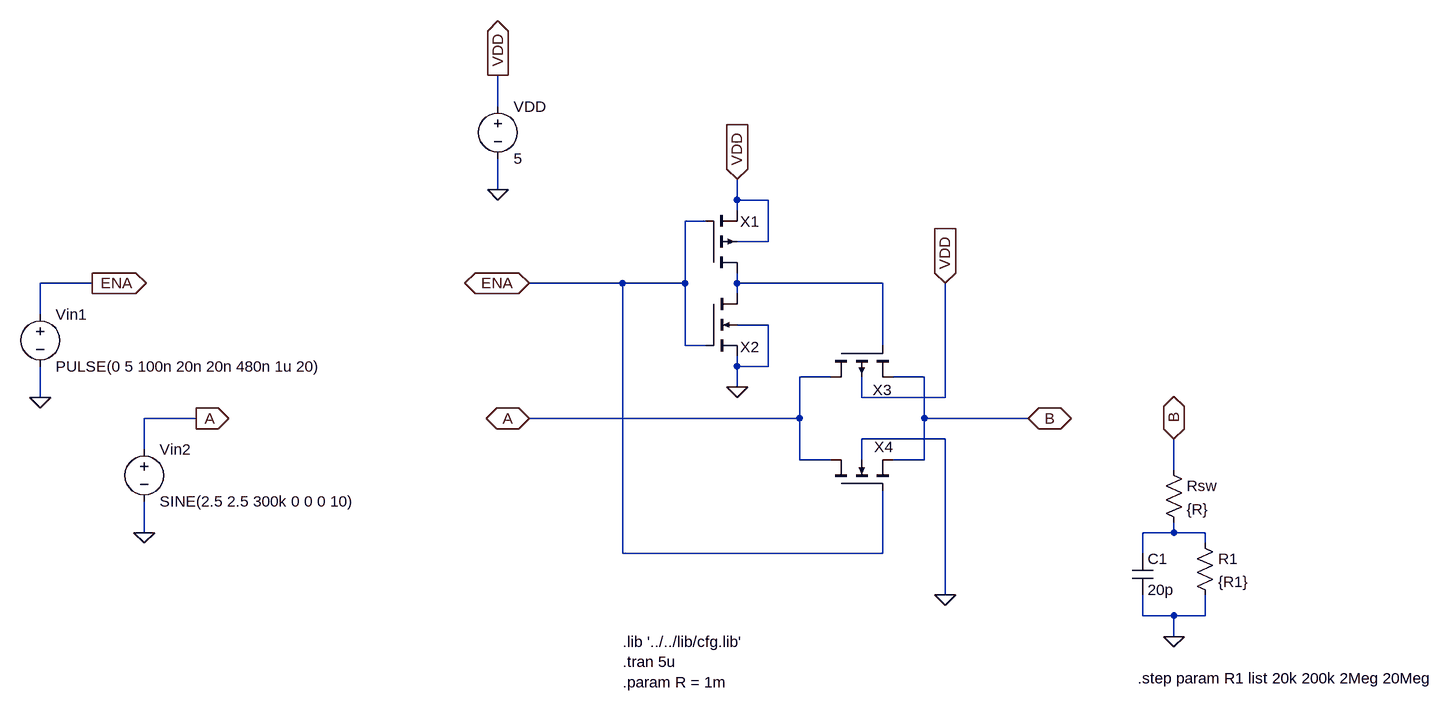
[diagram p0: schematic tg.asc]
tg.asc, the LTspice schematic file:
Version 4
SHEET 1 1232 752
WIRE -416 -304 -416 -352
WIRE -416 -176 -416 -224
WIRE -48 -160 -48 -192
WIRE 0 -160 -48 -160
WIRE -48 -144 -48 -160
WIRE -96 -128 -128 -128
WIRE 0 -96 0 -160
WIRE 0 -96 -48 -96
WIRE -1040 -32 -1120 -32
WIRE -224 -32 -368 -32
WIRE -128 -32 -128 -128
WIRE -128 -32 -224 -32
WIRE -48 -32 -48 -48
WIRE 176 -32 -48 -32
WIRE -48 -16 -48 -32
WIRE -1120 16 -1120 -32
WIRE 0 32 -48 32
WIRE -128 64 -128 -32
WIRE -96 64 -128 64
WIRE 176 64 176 -32
WIRE -48 96 -48 80
WIRE 0 96 0 32
WIRE 0 96 -48 96
WIRE 96 112 48 112
WIRE 240 112 192 112
WIRE -48 128 -48 96
WIRE -1120 144 -1120 96
WIRE 144 144 144 112
WIRE 272 144 272 -32
WIRE 272 144 144 144
WIRE -880 176 -960 176
WIRE 48 176 48 112
WIRE 48 176 -368 176
WIRE 240 176 240 112
WIRE 400 176 240 176
WIRE 272 208 144 208
WIRE -960 224 -960 176
WIRE 48 240 48 176
WIRE 96 240 48 240
WIRE 144 240 144 208
WIRE 240 240 240 176
WIRE 240 240 192 240
WIRE 624 256 624 208
WIRE -960 352 -960 304
WIRE 624 352 624 336
WIRE 624 352 576 352
WIRE 672 352 624 352
WIRE 672 368 672 352
WIRE -224 384 -224 -32
WIRE 176 384 176 288
WIRE 176 384 -224 384
WIRE 576 384 576 352
WIRE 272 448 272 208
WIRE 576 480 576 448
WIRE 624 480 576 480
WIRE 672 480 672 448
WIRE 672 480 624 480
WIRE 624 512 624 480
FLAG 272 448 0
FLAG -416 -176 0
FLAG 624 208 B
IOPIN 624 208 BiDir
FLAG -416 -352 VDD
IOPIN -416 -352 Out
FLAG 272 -32 VDD
IOPIN 272 -32 In
FLAG -1040 -32 ENA
IOPIN -1040 -32 Out
FLAG -48 128 0
FLAG -48 -192 VDD
IOPIN -48 -192 In
FLAG 400 176 B
IOPIN 400 176 BiDir
FLAG -368 176 A
IOPIN -368 176 BiDir
FLAG -368 -32 ENA
IOPIN -368 -32 BiDir
FLAG -1120 144 0
FLAG -880 176 A
IOPIN -880 176 Out
FLAG -960 352 0
FLAG 624 512 0
SYMBOL voltage -416 -320 R0
WINDOW 123 0 0 Left 2
WINDOW 39 24 124 Left 2
SYMATTR InstName VDD
SYMATTR Value 5
SYMBOL voltage -1120 0 R0
WINDOW 123 0 0 Left 2
WINDOW 39 0 0 Left 2
SYMATTR InstName Vin1
SYMATTR Value PULSE(0 5 100n 20n 20n 480n 1u 20)
SYMBOL cap 560 384 R0
SYMATTR InstName C1
SYMATTR Value 20p
SYMBOL res 656 352 R0
SYMATTR InstName R1
SYMATTR Value {R1}
SYMBOL res 608 240 R0
SYMATTR InstName Rsw
SYMATTR Value {R}
SYMBOL nmos4 96 288 R270
WINDOW 0 68 67 VRight 2
WINDOW 3 53 23 Invisible 2
SYMATTR InstName X4
SYMATTR Value nmos_t1
SYMATTR Prefix X
SYMBOL pmos4 96 64 M90
WINDOW 0 68 94 VLeft 2
WINDOW 3 52 23 Invisible 2
SYMATTR InstName X3
SYMATTR Value pmos_t1
SYMATTR Prefix X
SYMBOL nmos4 -96 -16 R0
WINDOW 0 53 82 Left 2
WINDOW 3 53 23 Invisible 2
SYMATTR InstName X2
SYMATTR Value nmos_t1
SYMATTR Prefix X
SYMBOL pmos4 -96 -48 M180
WINDOW 0 53 79 Left 2
WINDOW 3 52 23 Invisible 2
SYMATTR InstName X1
SYMATTR Value pmos_t1
SYMATTR Prefix X
SYMBOL voltage -960 208 R0
WINDOW 123 0 0 Left 2
WINDOW 39 0 0 Left 2
SYMATTR InstName Vin2
SYMATTR Value SINE(2.5 2.5 300k 0 0 0 10)
TEXT -224 520 Left 2 !.lib '../../lib/cfg.lib' \n.tran 5u\n.param R = 1m
TEXT 568 576 Left 2 !.step param R1 list 20k 200k 2Meg 20Meg

The netlist it stands for:
* tg.asc
VDD VDD 0 5
Vin1 ENA 0 PULSE(0 5 100n 20n 20n 480n 1u 20)
C1 N002 0 20p
R1 N002 0 {R1}
Rsw B N002 {R}
XX4 A ENA B 0 nmos_t1  ; pins D G S B
XX3 A N001 B VDD pmos_t1  ; pins D G S B
XX2 N001 ENA 0 0 nmos_t1  ; pins D G S B
XX1 N001 ENA VDD VDD pmos_t1  ; pins D G S B
Vin2 A 0 SINE(2.5 2.5 300k 0 0 0 10)
.lib '../../lib/cfg.lib'
.tran 5u
.param R = 1m
.step param R1 list 20k 200k 2Meg 20Meg
.backanno
.end